# EAGLE schematic 3109-comparisons (EAGLE 6.5.0)
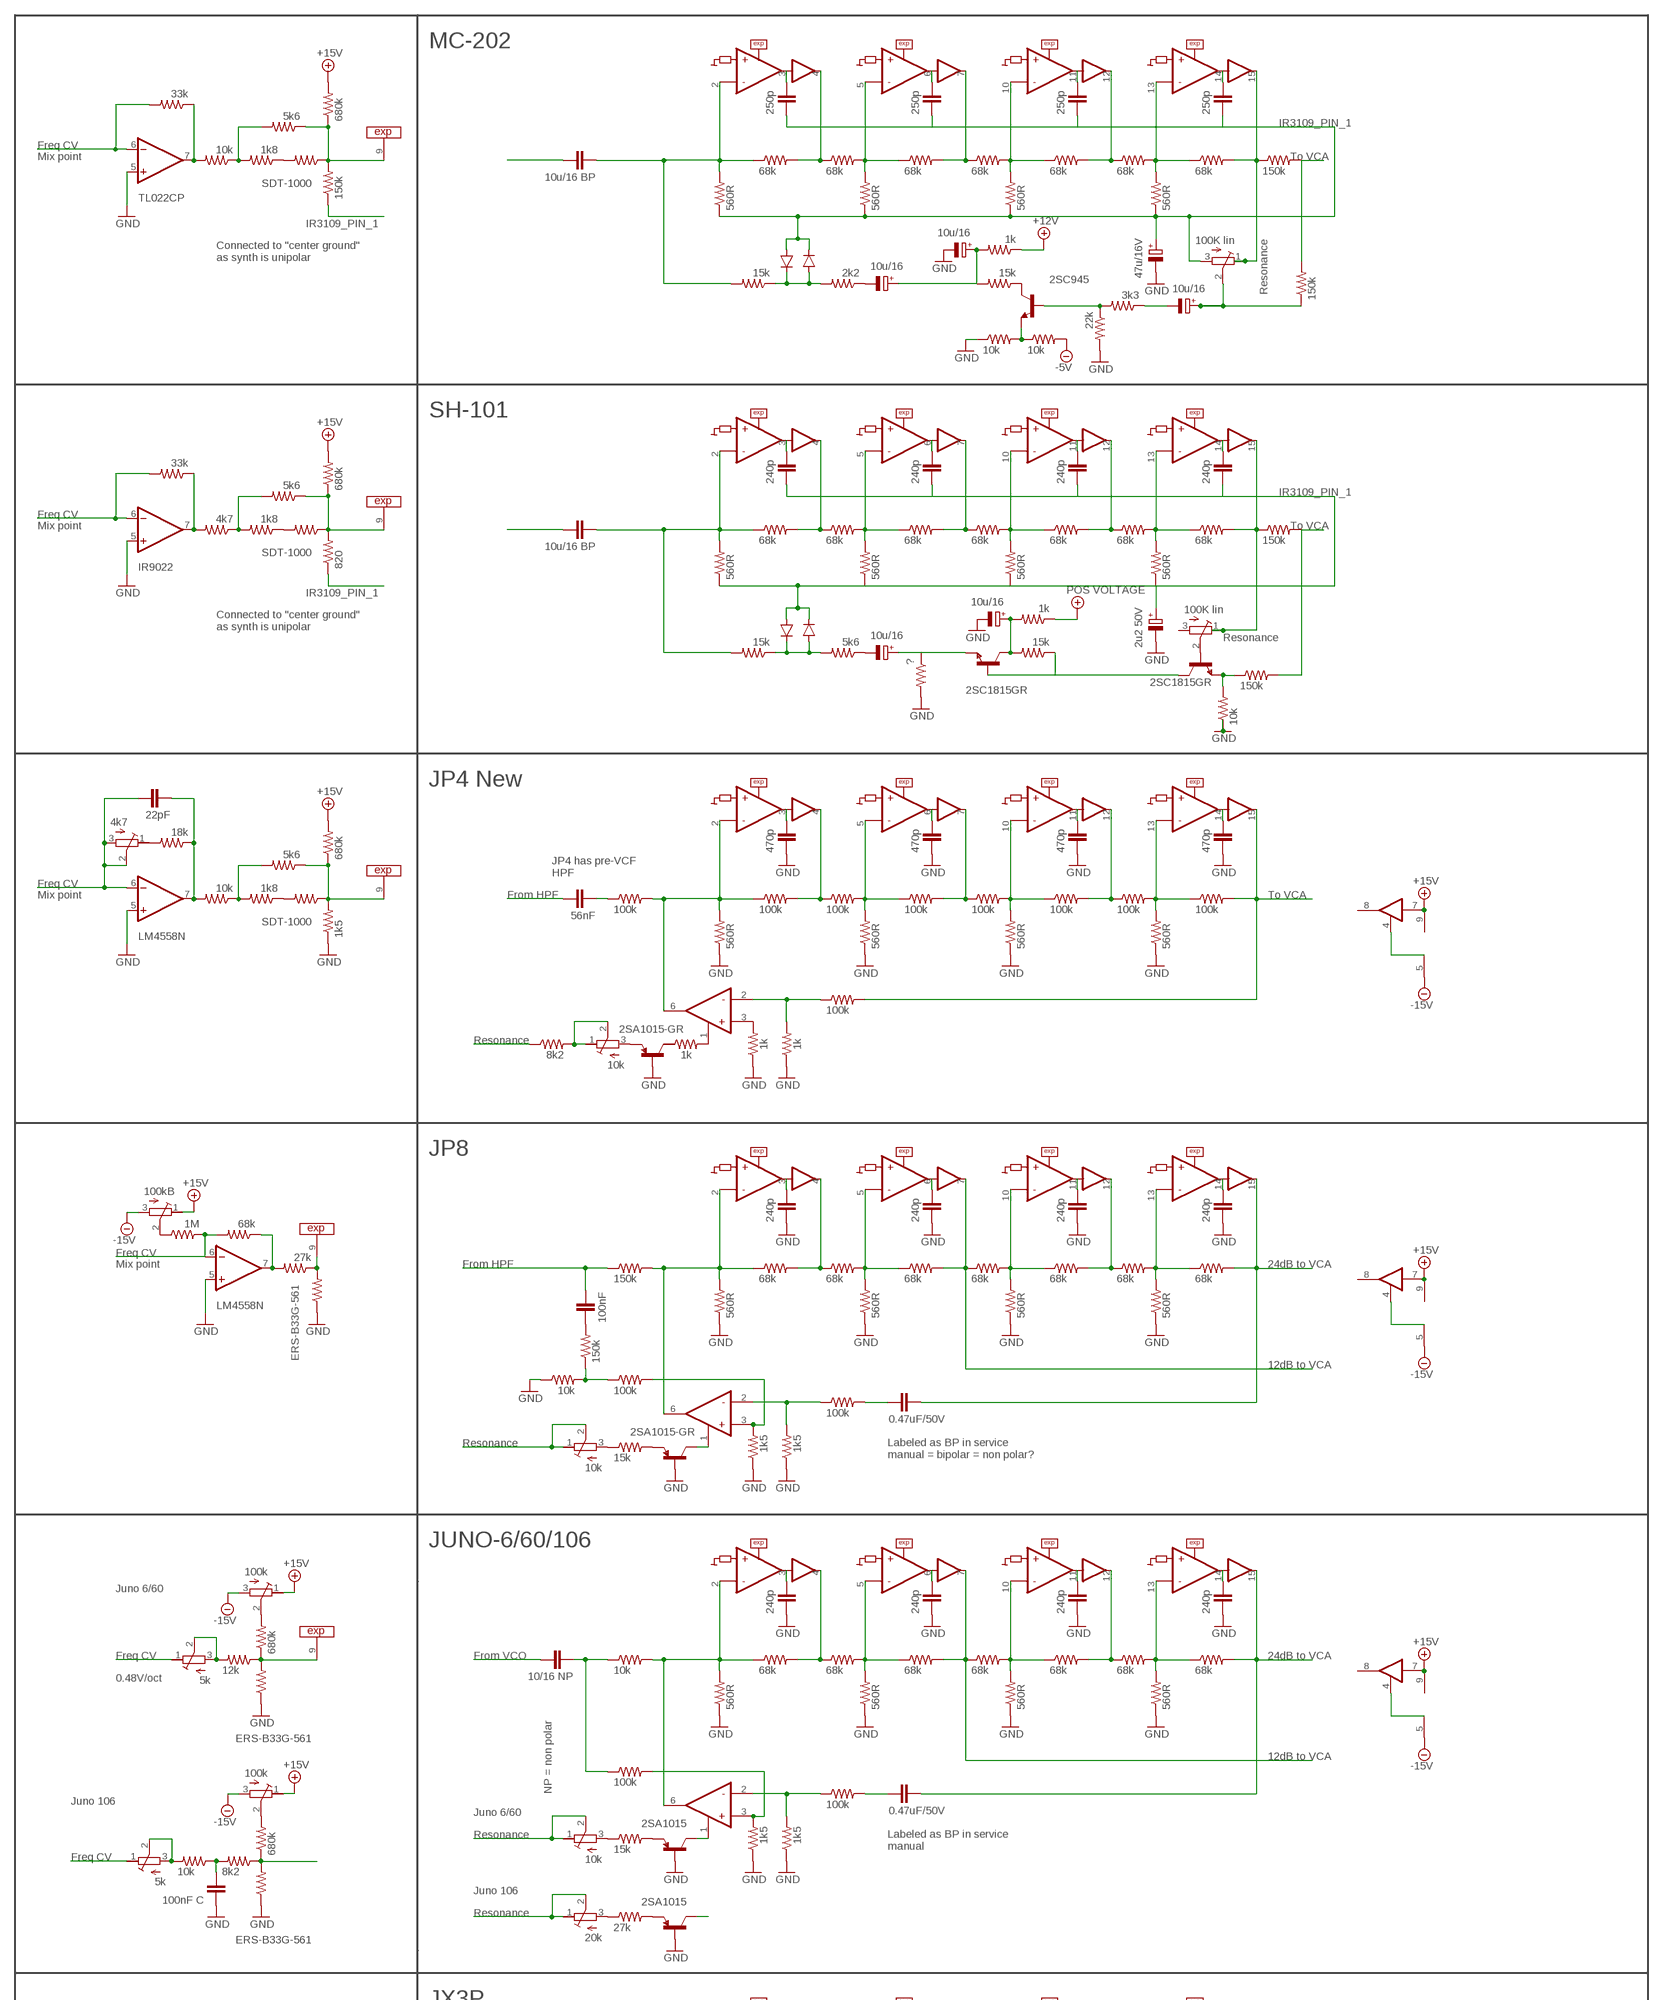
[diagram p0: schematic, sheet 1, part 1 of 2]
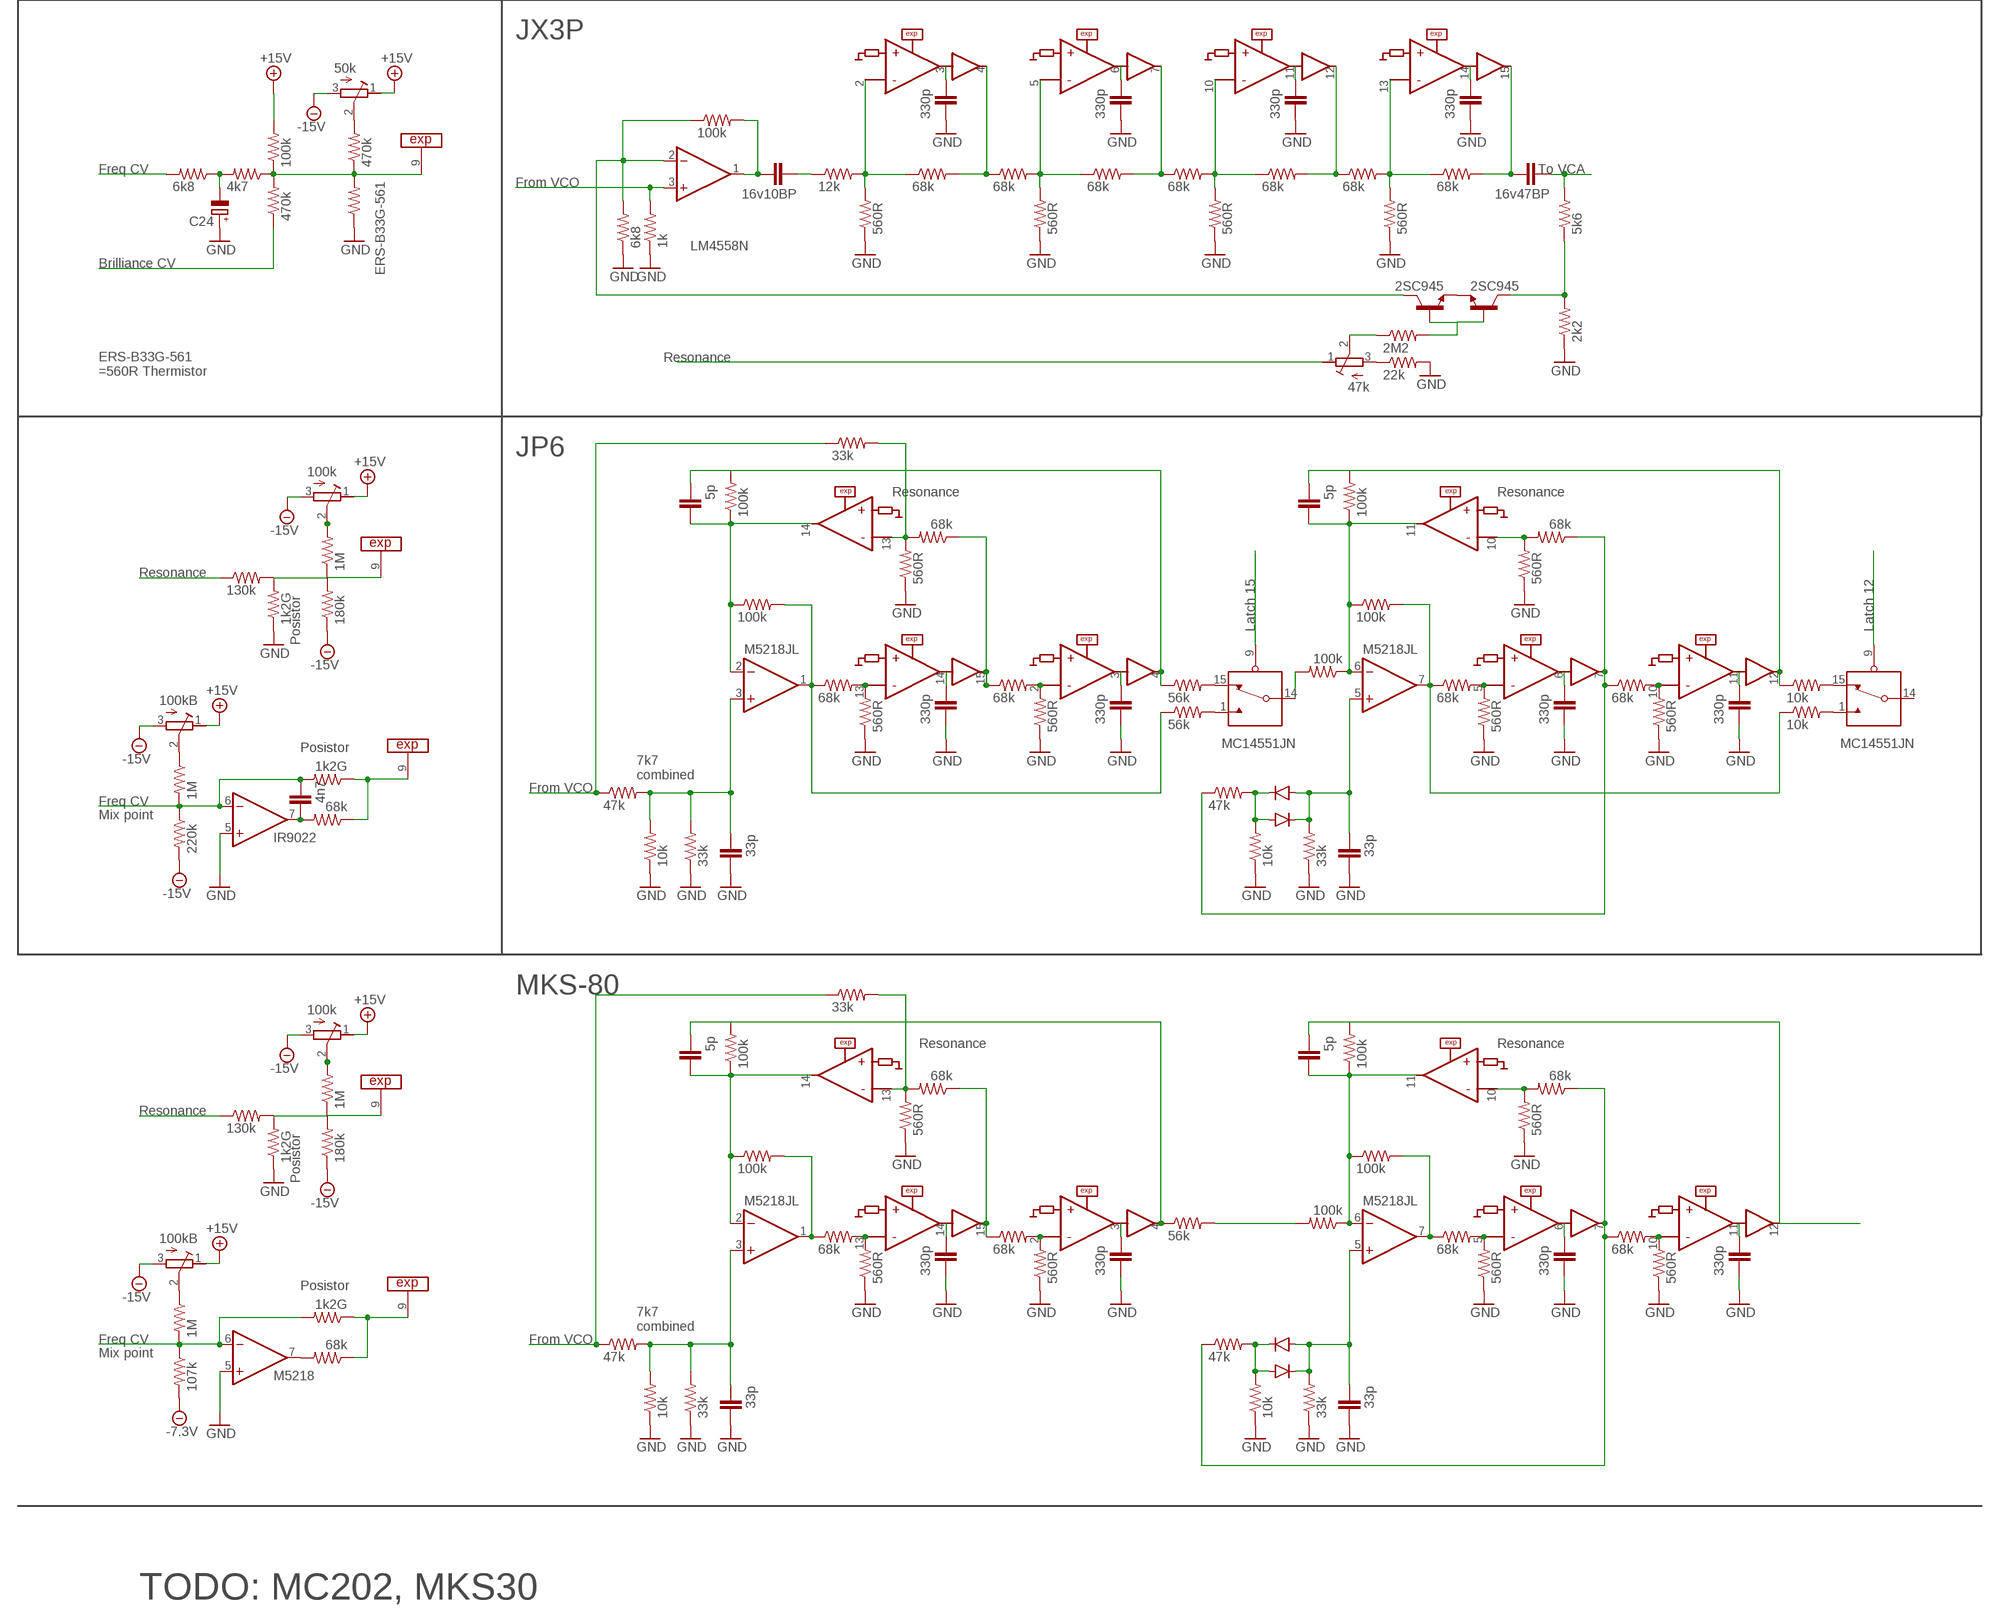
[diagram p1: schematic, sheet 1, part 2 of 2]

## Parts
C1  470p  C-EU025-024X044  [C025-024X044]
C2  470p  C-EU025-024X044  [C025-024X044]
C3  470p  C-EU025-024X044  [C025-024X044]
C4  470p  C-EU025-024X044  [C025-024X044]
C5  240p  C-EU025-024X044  [C025-024X044]
C6  240p  C-EU025-024X044  [C025-024X044]
C7  240p  C-EU025-024X044  [C025-024X044]
C8  240p  C-EU025-024X044  [C025-024X044]
C9  100nF  C-EU025-024X044  [C025-024X044]
C10  0.47uF/50V  C-EU025-024X044  [C025-024X044]
C11  240p  C-EU025-024X044  [C025-024X044]
C12  240p  C-EU025-024X044  [C025-024X044]
C13  240p  C-EU025-024X044  [C025-024X044]
C14  240p  C-EU025-024X044  [C025-024X044]
C15  10/16 NP  C-EU025-024X044  [C025-024X044]
C16  0.47uF/50V  C-EU025-024X044  [C025-024X044]
C17  330p  C-EU025-024X044  [C025-024X044]
C18  330p  C-EU025-024X044  [C025-024X044]
C19  330p  C-EU025-024X044  [C025-024X044]
C20  330p  C-EU025-024X044  [C025-024X044]
C21  16v47BP  C-EU025-024X044  [C025-024X044]
C22  16v10BP  C-EU025-024X044  [C025-024X044]
C23  56nF  C-EU025-024X044  [C025-024X044]
C24  CPOL-EUE2-5  [E2-5]
C25  22pF  C-EU025-024X044  [C025-024X044]
C26  100nF C  C-EU025-024X044  [C025-024X044]
C27  330p  C-EU025-024X044  [C025-024X044]
C28  330p  C-EU025-024X044  [C025-024X044]
C29  330p  C-EU025-024X044  [C025-024X044]
C30  330p  C-EU025-024X044  [C025-024X044]
C31  5p  C-EU025-024X044  [C025-024X044]
C32  33p  C-EU025-024X044  [C025-024X044]
C33  5p  C-EU025-024X044  [C025-024X044]
C34  33p  C-EU025-024X044  [C025-024X044]
C35  4n7  C-EU025-024X044  [C025-024X044]
C36  330p  C-EU025-024X044  [C025-024X044]
C37  330p  C-EU025-024X044  [C025-024X044]
C38  330p  C-EU025-024X044  [C025-024X044]
C39  330p  C-EU025-024X044  [C025-024X044]
C40  5p  C-EU025-024X044  [C025-024X044]
C41  33p  C-EU025-024X044  [C025-024X044]
C42  5p  C-EU025-024X044  [C025-024X044]
C43  33p  C-EU025-024X044  [C025-024X044]
C44  240p  C-EU025-024X044  [C025-024X044]
C45  240p  C-EU025-024X044  [C025-024X044]
C46  240p  C-EU025-024X044  [C025-024X044]
C47  240p  C-EU025-024X044  [C025-024X044]
C48  10u/16 BP  C-EU025-024X044  [C025-024X044]
C49  250p  C-EU025-024X044  [C025-024X044]
C50  2u2 50V  CPOL-EUE2-5  [E2-5]
C51  10u/16  CPOL-EUE2-5  [E2-5]
C52  10u/16  CPOL-EUE2-5  [E2-5]
C53  250p  C-EU025-024X044  [C025-024X044]
C54  250p  C-EU025-024X044  [C025-024X044]
C55  250p  C-EU025-024X044  [C025-024X044]
C56  10u/16 BP  C-EU025-024X044  [C025-024X044]
C57  47u/16V  CPOL-EUE2-5  [E2-5]
C58  10u/16  CPOL-EUE2-5  [E2-5]
C59  10u/16  CPOL-EUE2-5  [E2-5]
C60  10u/16  CPOL-EUE2-5  [E2-5]
D1  1S24735  [DO35-5J]
D2  1S24735  [DO35-5J]
D3  1S24735  [DO35-5J]
D4  1S24735  [DO35-5J]
D5  1S24735  [DO35-5J]
D6  1S24735  [DO35-5J]
D7  1S24735  [DO35-5J]
D8  1S24735  [DO35-5J]
IC1  LM4558N  [DIL08]
IC2  LM4558N  [DIL08]
IC3  LM4558N  [DIL08]
IC4  M5218JL  [SIP-8J]
IC5  MC14551JN  [DIL16J]
IC6  MC14551JN  [DIL16J]
IC7  M5218JL  [SIP-8J]
IC8  M5218  M5218JL  [SIP-8J]
IC9  IR9022  LM4558N  [DIL08]
IC10  TL022CP  LM4558N  [DIL08]
Q1  2SA1015  [TO-92J]
Q2  2SA1015-GR  2SA1015  [TO-92J]
Q3  2SA1015-GR  2SA1015  [TO-92J]
Q4  2SA1015  [TO-92J]
R1  100k  R-US_0204/7  [0204/7]
R2  100k  R-US_0204/7  [0204/7]
R3  100k  R-US_0204/7  [0204/7]
R4  100k  R-US_0204/7  [0204/7]
R5  100k  R-US_0204/7  [0204/7]
R6  100k  R-US_0204/7  [0204/7]
R7  100k  R-US_0204/7  [0204/7]
R8  560R  R-US_0204/7  [0204/7]
R9  560R  R-US_0204/7  [0204/7]
R10  560R  R-US_0204/7  [0204/7]
R11  560R  R-US_0204/7  [0204/7]
R12  100k  R-US_0204/7  [0204/7]
R13  1k  R-US_0204/7  [0204/7]
R14  1k  R-US_0204/7  [0204/7]
R15  100k  R-US_0204/7  [0204/7]
R16  68k  R-US_0204/7  [0204/7]
R17  68k  R-US_0204/7  [0204/7]
R18  68k  R-US_0204/7  [0204/7]
R19  68k  R-US_0204/7  [0204/7]
R20  68k  R-US_0204/7  [0204/7]
R21  68k  R-US_0204/7  [0204/7]
R22  68k  R-US_0204/7  [0204/7]
R23  560R  R-US_0204/7  [0204/7]
R24  560R  R-US_0204/7  [0204/7]
R25  560R  R-US_0204/7  [0204/7]
R26  560R  R-US_0204/7  [0204/7]
R27  100k  R-US_0204/7  [0204/7]
R28  1k5  R-US_0204/7  [0204/7]
R29  1k5  R-US_0204/7  [0204/7]
R30  150k  R-US_0204/7  [0204/7]
R31  100k  R-US_0204/7  [0204/7]
R32  10k  R-US_0204/7  [0204/7]
R33  150k  R-US_0204/7  [0204/7]
R34  68k  R-US_0204/7  [0204/7]
R35  68k  R-US_0204/7  [0204/7]
R36  68k  R-US_0204/7  [0204/7]
R37  68k  R-US_0204/7  [0204/7]
R38  68k  R-US_0204/7  [0204/7]
R39  68k  R-US_0204/7  [0204/7]
R40  68k  R-US_0204/7  [0204/7]
R41  560R  R-US_0204/7  [0204/7]
R42  560R  R-US_0204/7  [0204/7]
R43  560R  R-US_0204/7  [0204/7]
R44  560R  R-US_0204/7  [0204/7]
R45  100k  R-US_0204/7  [0204/7]
R46  1k5  R-US_0204/7  [0204/7]
R47  1k5  R-US_0204/7  [0204/7]
R48  10k  R-US_0204/7  [0204/7]
R49  100k  R-US_0204/7  [0204/7]
R50  15k  R-US_0204/7  [0204/7]
R51  10k  R-TRIMMT93XA  [RTRIMT93XA]
R52  15k  R-US_0204/7  [0204/7]
R53  10k  R-TRIMMT93XA  [RTRIMT93XA]
R54  68k  R-US_0204/7  [0204/7]
R55  68k  R-US_0204/7  [0204/7]
R56  68k  R-US_0204/7  [0204/7]
R57  68k  R-US_0204/7  [0204/7]
R58  68k  R-US_0204/7  [0204/7]
R59  68k  R-US_0204/7  [0204/7]
R60  68k  R-US_0204/7  [0204/7]
R61  560R  R-US_0204/7  [0204/7]
R62  560R  R-US_0204/7  [0204/7]
R63  560R  R-US_0204/7  [0204/7]
R64  560R  R-US_0204/7  [0204/7]
R65  12k  R-US_0204/7  [0204/7]
R66  5k6  R-US_0204/7  [0204/7]
R67  2k2  R-US_0204/7  [0204/7]
R68  100k  R-US_0204/7  [0204/7]
R69  1k  R-US_0204/7  [0204/7]
R70  6k8  R-US_0204/7  [0204/7]
R71  2M2  R-US_0204/7  [0204/7]
R72  47k  R-TRIMMT93XA  [RTRIMT93XA]
R73  22k  R-US_0204/7  [0204/7]
R74  8k2  R-US_0204/7  [0204/7]
R75  10k  R-TRIMMT93XA  [RTRIMT93XA]
R76  1k  R-US_0204/7  [0204/7]
R77  ERS-B33G-561  R-US_0204/7  [0204/7]
R78  27k  R-US_0204/7  [0204/7]
R79  68k  R-US_0204/7  [0204/7]
R80  1M  R-US_0204/7  [0204/7]
R81  100kB  R-TRIMMT93XA  [RTRIMT93XA]
R82  ERS-B33G-561  R-US_0204/7  [0204/7]
R83  4k7  R-US_0204/7  [0204/7]
R84  100k  R-US_0204/7  [0204/7]
R85  ERS-B33G-561  R-US_0204/7  [0204/7]
R86  50k  R-TRIMMT93XA  [RTRIMT93XA]
R87  470k  R-US_0204/7  [0204/7]
R88  470k  R-US_0204/7  [0204/7]
R89  6k8  R-US_0204/7  [0204/7]
R90  12k  R-US_0204/7  [0204/7]
R91  5k  R-TRIMMT93XA  [RTRIMT93XA]
R92  100k  R-TRIMMT93XA  [RTRIMT93XA]
R93  680k  R-US_0204/7  [0204/7]
R94  1k5  R-US_0204/7  [0204/7]
R95  SDT-1000  R-US_0204/7  [0204/7]
R96  27k  R-US_0204/7  [0204/7]
R97  20k  R-TRIMMT93XA  [RTRIMT93XA]
R98  ERS-B33G-561  R-US_0204/7  [0204/7]
R99  1k8  R-US_0204/7  [0204/7]
R100  10k  R-US_0204/7  [0204/7]
R101  18k  R-US_0204/7  [0204/7]
R102  4k7  R-TRIMMT93XA  [RTRIMT93XA]
R103  5k6  R-US_0204/7  [0204/7]
R104  680k  R-US_0204/7  [0204/7]
R105  8k2  R-US_0204/7  [0204/7]
R106  100k  R-TRIMMT93XA  [RTRIMT93XA]
R107  680k  R-US_0204/7  [0204/7]
R108  5k  R-TRIMMT93XA  [RTRIMT93XA]
R109  10k  R-US_0204/7  [0204/7]
R110  56k  R-US_0204/7  [0204/7]
R111  68k  R-US_0204/7  [0204/7]
R112  56k  R-US_0204/7  [0204/7]
R113  68k  R-US_0204/7  [0204/7]
R114  10k  R-US_0204/7  [0204/7]
R115  68k  R-US_0204/7  [0204/7]
R116  10k  R-US_0204/7  [0204/7]
R117  560R  R-US_0204/7  [0204/7]
R118  560R  R-US_0204/7  [0204/7]
R119  560R  R-US_0204/7  [0204/7]
R120  560R  R-US_0204/7  [0204/7]
R121  68k  R-US_0204/7  [0204/7]
R122  68k  R-US_0204/7  [0204/7]
R123  560R  R-US_0204/7  [0204/7]
R124  100k  R-US_0204/7  [0204/7]
R125  100k  R-US_0204/7  [0204/7]
R126  33k  R-US_0204/7  [0204/7]
R127  10k  R-US_0204/7  [0204/7]
R128  47k  R-US_0204/7  [0204/7]
R129  33k  R-US_0204/7  [0204/7]
R130  100k  R-US_0204/7  [0204/7]
R131  68k  R-US_0204/7  [0204/7]
R132  560R  R-US_0204/7  [0204/7]
R133  100k  R-US_0204/7  [0204/7]
R134  100k  R-US_0204/7  [0204/7]
R135  33k  R-US_0204/7  [0204/7]
R136  10k  R-US_0204/7  [0204/7]
R137  47k  R-US_0204/7  [0204/7]
R138  100k  R-TRIMMT93XA  [RTRIMT93XA]
R139  1k2G  R-US_0204/7  [0204/7]
R140  130k  R-US_0204/7  [0204/7]
R141  1k2G  R-US_0204/7  [0204/7]
R142  180k  R-US_0204/7  [0204/7]
R143  1M  R-US_0204/7  [0204/7]
R144  68k  R-US_0204/7  [0204/7]
R145  220k  R-US_0204/7  [0204/7]
R146  1M  R-US_0204/7  [0204/7]
R147  100kB  R-TRIMMT93XA  [RTRIMT93XA]
R148  68k  R-US_0204/7  [0204/7]
R149  68k  R-US_0204/7  [0204/7]
R150  68k  R-US_0204/7  [0204/7]
R151  560R  R-US_0204/7  [0204/7]
R152  560R  R-US_0204/7  [0204/7]
R153  560R  R-US_0204/7  [0204/7]
R154  560R  R-US_0204/7  [0204/7]
R155  68k  R-US_0204/7  [0204/7]
R156  56k  R-US_0204/7  [0204/7]
R157  130k  R-US_0204/7  [0204/7]
R158  1k2G  R-US_0204/7  [0204/7]
R159  180k  R-US_0204/7  [0204/7]
R160  68k  R-US_0204/7  [0204/7]
R161  560R  R-US_0204/7  [0204/7]
R162  100k  R-US_0204/7  [0204/7]
R163  100k  R-US_0204/7  [0204/7]
R164  33k  R-US_0204/7  [0204/7]
R165  10k  R-US_0204/7  [0204/7]
R166  47k  R-US_0204/7  [0204/7]
R167  33k  R-US_0204/7  [0204/7]
R168  100k  R-US_0204/7  [0204/7]
R169  68k  R-US_0204/7  [0204/7]
R170  560R  R-US_0204/7  [0204/7]
R171  100k  R-US_0204/7  [0204/7]
R172  100k  R-US_0204/7  [0204/7]
R173  33k  R-US_0204/7  [0204/7]
R174  10k  R-US_0204/7  [0204/7]
R175  47k  R-US_0204/7  [0204/7]
R176  1M  R-US_0204/7  [0204/7]
R177  100k  R-TRIMMT93XA  [RTRIMT93XA]
R178  68k  R-US_0204/7  [0204/7]
R179  1M  R-US_0204/7  [0204/7]
R180  100kB  R-TRIMMT93XA  [RTRIMT93XA]
R181  1k2G  R-US_0204/7  [0204/7]
R182  107k  R-US_0204/7  [0204/7]
R183  68k  R-US_0204/7  [0204/7]
R184  68k  R-US_0204/7  [0204/7]
R185  68k  R-US_0204/7  [0204/7]
R186  68k  R-US_0204/7  [0204/7]
R187  68k  R-US_0204/7  [0204/7]
R188  68k  R-US_0204/7  [0204/7]
R189  68k  R-US_0204/7  [0204/7]
R190  560R  R-US_0204/7  [0204/7]
R191  560R  R-US_0204/7  [0204/7]
R192  560R  R-US_0204/7  [0204/7]
R193  560R  R-US_0204/7  [0204/7]
R194  150k  R-US_0204/7  [0204/7]
R195  150k  R-US_0204/7  [0204/7]
R196  100K lin  R-TRIMMT93XA  [RTRIMT93XA]
R197  68k  R-US_0204/7  [0204/7]
R198  15k  R-US_0204/7  [0204/7]
R199  1k  R-US_0204/7  [0204/7]
R200  ?  R-US_0204/7  [0204/7]
R201  820  R-US_0204/7  [0204/7]
R202  SDT-1000  R-US_0204/7  [0204/7]
R203  1k8  R-US_0204/7  [0204/7]
R204  4k7  R-US_0204/7  [0204/7]
R205  33k  R-US_0204/7  [0204/7]
R206  5k6  R-US_0204/7  [0204/7]
R207  680k  R-US_0204/7  [0204/7]
R208  15k  R-US_0204/7  [0204/7]
R209  10k  R-US_0204/7  [0204/7]
R212  68k  R-US_0204/7  [0204/7]
R213  68k  R-US_0204/7  [0204/7]
R214  68k  R-US_0204/7  [0204/7]
R215  10k  R-US_0204/7  [0204/7]
R216  5k6  R-US_0204/7  [0204/7]
R217  15k  R-US_0204/7  [0204/7]
R218  68k  R-US_0204/7  [0204/7]
R219  68k  R-US_0204/7  [0204/7]
R220  68k  R-US_0204/7  [0204/7]
R221  560R  R-US_0204/7  [0204/7]
R222  560R  R-US_0204/7  [0204/7]
R223  560R  R-US_0204/7  [0204/7]
R224  560R  R-US_0204/7  [0204/7]
R225  150k  R-US_0204/7  [0204/7]
R226  150k  R-US_0204/7  [0204/7]
R227  SDT-1000  R-US_0204/7  [0204/7]
R228  1k8  R-US_0204/7  [0204/7]
R229  10k  R-US_0204/7  [0204/7]
R230  33k  R-US_0204/7  [0204/7]
R231  5k6  R-US_0204/7  [0204/7]
R232  680k  R-US_0204/7  [0204/7]
R237  150k  R-US_0204/7  [0204/7]
R238  10k  R-US_0204/7  [0204/7]
R239  100K lin  R-TRIMMT93XA  [RTRIMT93XA]
R241  1k  R-US_0204/7  [0204/7]
R243  2k2  R-US_0204/7  [0204/7]
R244  15k  R-US_0204/7  [0204/7]
R245  3k3  R-US_0204/7  [0204/7]
R246  22k  R-US_0204/7  [0204/7]
T3  2SC945  [TO92-ECB]
T4  2SC945  [TO92-ECB]
T5  2SC1815GR  2SC945  [TO92-ECB]
T6  2SC1815GR  2SC945  [TO92-ECB]
T10  2SC945  [TO92-ECB]
U$1  IR3109  [DIL16J]
U$2  BA662-J  [SIP-9J]
U$3  IR3109  [DIL16J]
U$4  BA662-J  [SIP-9J]
U$5  IR3109  [DIL16J]
U$6  BA662-J  [SIP-9J]
U$7  IR3109  [DIL16J]
U$8  IR9022  [DIL08J]
U$9  IR3109  [DIL16J]
U$10  IR3109  [DIL16J]
U$11  IR3109-OTA  [DIL16J]
U$12  IR3109-OTA  [DIL16J]
U$13  IR3109  [DIL16J]
U$14  IR3109-OTA  [DIL16J]
U$15  IR3109  [DIL16J]
U$17  IR3109  [DIL16J]

## Nets
+12V: R241.1
+15V: R81.1(A) R84.2 R86.1(A) R92.1(A) R104.2 R106.1(A) R138.1(A) R147.1(A) R177.1(A) R180.1(A) R199.1 R207.2 R232.2 U$2.7(IN_BUFF) U$2.9(V+) U$4.7(IN_BUFF) U$4.9(V+) U$6.7(IN_BUFF) U$6.9(V+) ; supply symbol labelled POS VOLTAGE
-5V: R238.2
-8V: R182.2 ; supply symbol labelled -7.3V
-15V: R81.3(E) R86.3(E) R92.3(E) R106.3(E) R138.3(E) R142.1 R145.2 R147.3(E) R159.1 R177.3(E) R180.3(E) U$2.5(V-) U$4.5(V-) U$6.5(V-)
GND: C1.2 C2.2 C3.2 C4.2 C5.2 C6.2 C7.2 C8.2 C11.2 C12.2 C13.2 C14.2 C17.2 C18.2 C19.2 C20.2 C24.+ C26.2 C27.2 C28.2 C29.2 C30.2 C32.1 C34.1 C36.2 C37.2 C38.2 C39.2 C41.1 C43.1 C50.- C51.- C57.- C58.- IC1.5(B:+IN) IC3.5(B:+IN) IC8.5(B:+IN) IC9.5(B:+IN) IC10.5(B:+IN) Q1.3(B) Q2.3(B) Q3.3(B) Q4.3(B) R8.1 R9.1 R10.1 R11.1 R13.1 R14.1 R23.1 R24.1 R25.1 R26.1 R28.1 R29.1 R32.1 R41.1 R42.1 R43.1 R44.1 R46.1 R47.1 R61.1 R62.1 R63.1 R64.1 R67.1 R69.1 R70.1 R73.2 R77.1 R82.1 R85.1 R94.1 R98.1 R117.1 R118.1 R119.1 R120.1 R123.1 R126.1 R127.1 R132.1 R135.1 R136.1 R141.1 R151.1 R152.1 R153.1 R154.1 R158.1 R161.1 R164.1 R165.1 R170.1 R173.1 R174.1 R200.2 R209.1 R215.1 R246.2 U$8.5(+IN)
IR3109_PIN_1: C44.2 C45.2 C46.2 C47.2 C49.2 C50.+ C53.2 C54.2 C55.2 C57.+ D5.C D6.A D7.C D8.A R190.1 R191.1 R192.1 R193.1 R201.1 R221.1 R222.1 R223.1 R224.1 R226.1 R239.3(E)
N$1: C1.1 U$1.3(CAP)
N$2: C2.1 U$1.6(CAP)
N$3: C3.1 U$1.11(CAP)
N$4: C4.1 U$1.14(CAP)
N$5: R1.2 R2.1 U$1.4(OUT)
N$6: R1.1 R9.2 R15.2 U$1.2(IN) U$2.6(OUT_OTA)
N$7: R2.2 R3.1 R8.2 U$1.5(IN)
N$8: R3.2 R4.1 U$1.7(OUT)
N$9: R4.2 R5.1 R10.2 U$1.10(IN)
N$10: R5.2 R6.1 U$1.12(OUT)
N$11: R6.2 R7.1 R11.2 U$1.13(IN)
N$12: R7.2 R12.2 U$1.15(OUT)
N$13: R14.2 U$2.3(+)
N$14: R12.1 R13.2 U$2.2(-)
N$15: C23.2 R15.1
N$16: R76.2 U$2.1(C_OTA)
N$17: U$2.4(C_BUFF)
N$18: R95.2 R99.1
N$19: C5.1 U$3.3(CAP)
N$20: C6.1 U$3.6(CAP)
N$21: C7.1 U$3.11(CAP)
N$22: C8.1 U$3.14(CAP)
N$23: R16.2 R17.1 U$3.4(OUT)
N$24: R16.1 R24.2 R30.2 U$3.2(IN) U$4.6(OUT_OTA)
N$25: R17.2 R18.1 R23.2 U$3.5(IN)
N$26: R18.2 R19.1 U$3.7(OUT)
N$27: R19.2 R20.1 R25.2 U$3.10(IN)
N$28: R20.2 R21.1 U$3.12(OUT)
N$29: R21.2 R22.1 R26.2 U$3.13(IN)
N$30: C10.1 R22.2 U$3.15(OUT)
N$31: R29.2 R31.2 U$4.3(+)
N$32: R27.1 R28.2 U$4.2(-)
N$33: C9.1 R30.1
N$34: Q3.1(E) R75.3(E)
N$35: U$4.4(C_BUFF)
N$36: R80.1 R81.2(S)
N$37: R31.1 R32.2 R33.1
N$38: C9.2 R33.2
N$39: C10.2 R27.2
N$40: C11.1 U$5.3(CAP)
N$41: C12.1 U$5.6(CAP)
N$42: C13.1 U$5.11(CAP)
N$43: C14.1 U$5.14(CAP)
N$44: R34.2 R35.1 U$5.4(OUT)
N$45: R34.1 R42.2 R48.2 U$5.2(IN) U$6.6(OUT_OTA)
N$46: R35.2 R36.1 R41.2 U$5.5(IN)
N$47: R36.2 R37.1 U$5.7(OUT)
N$48: R37.2 R38.1 R43.2 U$5.10(IN)
N$49: R38.2 R39.1 U$5.12(OUT)
N$50: R39.2 R40.1 R44.2 U$5.13(IN)
N$51: C16.1 R40.2 U$5.15(OUT)
N$52: R47.2 R49.2 U$6.3(+)
N$53: R45.1 R46.2 U$6.2(-)
N$54: C15.2 R48.1 R49.1
N$55: Q1.2(C) U$6.1(C_OTA)
N$56: U$6.4(C_BUFF)
N$57: C28.1 U$9.3(CAP)
N$58: C15.1
N$59: Q1.1(E) R50.2
N$60: C16.2 R45.2
N$61: R50.1 R51.3(E)
N$62: R51.1(A) R51.2(S)
N$63: R74.1
N$64: Q2.2(C) U$4.1(C_OTA)
N$65: C17.1 U$7.3(CAP)
N$66: C18.1 U$7.6(CAP)
N$67: C19.1 U$7.11(CAP)
N$68: C20.1 U$7.14(CAP)
N$69: R54.2 R55.1 U$7.4(OUT)
N$70: R54.1 R62.2 R65.2 U$7.2(IN)
N$71: R55.2 R56.1 R61.2 U$7.5(IN)
N$72: R56.2 R57.1 U$7.7(OUT)
N$73: R57.2 R58.1 R63.2 U$7.10(IN)
N$74: R58.2 R59.1 U$7.12(OUT)
N$75: R59.2 R60.1 R64.2 U$7.13(IN)
N$76: IC2.2(A:-IN) R68.1 R70.2 T3.C
N$77: C22.2 R65.1
N$78: R72.1(A)
N$79: R152.2 R155.2 U$10.13(IN)
N$80: R90.2 R91.2(S) R91.3(E)
N$81: C21.1 R60.2 U$7.15(OUT)
N$82: C21.2 R66.2
N$83: C22.1 IC2.1(A:OUT) R68.2
N$84: IC2.3(A:+IN) R69.2
N$85: R66.1 R67.2 T4.C
N$86: T3.E T4.E
N$87: R71.2 T3.B T4.B
N$88: R71.1 R72.2(S)
N$89: R72.3(E) R73.1
N$90: Q2.1(E) R52.2
N$91: R52.1 R53.3(E)
N$92: R53.1(A) R53.2(S)
N$93: C23.1
N$94: R74.2 R75.1(A) R75.2(S)
N$95: IC1.7(B:OUT) R78.2 R79.1
N$96: IC1.6(B:-IN) R79.2 R80.2
N$97: R82.2 R83.1 R84.1 R87.1 R88.2 U$7.9(CTRL)
N$98: R77.2 R78.1 U$3.9(CTRL)
N$99: R88.1
N$100: C24.- R83.2 R89.1
N$101: R86.2(S) R87.2
N$102: R89.2
N$103: R92.2(S) R93.2
N$104: R85.2 R90.1 R93.1 U$5.9(CTRL)
N$105: R99.2 R100.1 R103.2
N$106: R91.1(A)
N$107: C25.2 IC3.7(B:OUT) R100.2 R101.1
N$108: C25.1 IC3.6(B:-IN) R102.2(S) R102.3(E)
N$109: R94.2 R95.1 R103.1 R104.1 U$1.9(CTRL)
N$110: Q4.2(C)
N$111: R101.2 R102.1(A)
N$112: Q4.1(E) R96.2
N$113: R96.1 R97.3(E)
N$114: R97.1(A) R97.2(S)
N$115: R106.2(S) R107.2
N$116: R98.2 R105.1 R107.1
N$117: R108.1(A)
N$118: R108.2(S) R108.3(E) R109.2
N$119: C26.1 R105.2 R109.1
N$120: R128.1 R129.1
N$121: C27.1 U$9.14(CAP)
N$122: R111.1 R122.1 U$9.15(OUT)
N$123: C30.1 U$9.11(CAP)
N$124: R118.2 R121.2 U$9.13(IN)
N$125: R111.2 R117.2 U$9.2(IN)
N$126: C33.2 R114.1 R134.2 U$9.12(OUT)
N$127: R113.2 R119.2 U$9.5(IN)
N$128: C29.1 U$9.6(CAP)
N$129: R115.2 R120.2 U$9.10(IN)
N$130: R115.1 R131.1 R137.1 U$9.7(OUT)
N$131: IC4.1(A:OUT) R112.1 R121.1 R124.2
N$132: IC4.7(B:OUT) R113.1 R116.1 R133.2
N$133: R148.2 R151.2 U$10.2(IN)
N$134: R122.2 R123.2 R129.2 U$11.13(IN)
N$135: C31.1 IC4.2(A:-IN) R124.1 R125.1 U$11.14(CAP)
N$136: C31.2 R110.1 R125.2 U$9.4(OUT)
N$137: IC5.9(CTRL)
N$138: IC5.15 R110.2
N$139: IC5.1 R112.2
N$140: IC6.15 R114.2
N$141: IC6.1 R116.2
N$142: IC5.14(COM) R130.2
N$143: IC6.9(CTRL)
N$144: U$11.9(CTRL)
N$145: R131.2 R132.2 U$11.10(IN)
N$146: R138.2(S) R143.2
N$147: C33.1 IC4.6(B:-IN) R130.1 R133.1 R134.1
N$148: D1.A D2.C R136.2 R137.2
N$149: C34.2 D1.C D2.A IC4.5(B:+IN) R135.2
N$150: R140.1
N$151: C32.2 IC4.3(A:+IN) R126.2 R127.2 R128.2
N$152: R139.1 R144.1 U$9.9(CTRL)
N$153: C35.2 R139.2 R145.1 R146.2 U$8.6(-IN)
N$154: R140.2 R141.2 R142.2 R143.1
N$155: IC8.7(B:OUT) R178.2
N$156: R146.1 R147.2(S)
N$157: R149.2 R153.2 U$10.5(IN)
N$158: R150.2 R154.2 U$10.10(IN)
N$159: R156.2 R168.2
N$160: IC7.7(B:OUT) R149.1 R171.2
N$161: R160.2 R161.2 R167.2 U$12.13(IN)
N$162: C37.1 U$10.3(CAP)
N$163: C36.1 U$10.14(CAP)
N$164: R148.1 R160.1 U$10.15(OUT)
N$165: C39.1 U$10.11(CAP)
N$166: C42.2 R172.2 U$10.12(OUT)
N$167: C38.1 U$10.6(CAP)
N$168: R150.1 R169.1 R175.1 U$10.7(OUT)
N$169: C40.1 IC7.2(A:-IN) R162.1 R163.1 U$12.14(CAP)
N$170: C40.2 R156.1 R163.2 U$10.4(OUT)
N$171: R166.1 R167.1
N$172: IC7.1(A:OUT) R155.1 R162.2
N$173: U$14.9(CTRL)
N$174: R157.2 R158.2 R159.2 R176.1
N$175: R176.2 R177.2(S)
N$176: R157.1
N$177: R169.2 R170.2 U$12.10(IN)
N$178: C42.1 IC7.6(B:-IN) R168.1 R171.1 R172.1 U$12.11(CAP)
N$179: D3.A D4.C R174.2 R175.2
N$180: C43.2 D3.C D4.A IC7.5(B:+IN) R173.2
N$181: C41.2 IC7.3(A:+IN) R164.2 R165.2 R166.2
N$182: R179.1 R180.2(S)
N$183: IC8.6(B:-IN) R179.2 R181.2 R182.1
N$184: C44.1 U$15.3(CAP)
N$185: R178.1 R181.1 U$13.9(CTRL)
N$186: C35.1 R144.2 U$8.7(OUT)
N$187: C45.1 U$15.6(CAP)
N$188: C46.1 U$15.11(CAP)
N$189: C47.1 U$15.14(CAP)
N$190: R183.2 R184.1 U$15.4(OUT)
N$191: C49.1 U$17.3(CAP)
N$192: R184.2 R185.1 R190.2 U$15.5(IN)
N$193: R185.2 R186.1 U$15.7(OUT)
N$194: R186.2 R187.1 R192.2 U$15.10(IN)
N$195: R187.2 R188.1 U$15.12(OUT)
N$196: R188.2 R189.1 R193.2 U$15.13(IN)
N$197: R196.2(S) T5.B
N$198: R189.2 R195.1 R196.1(A) U$15.15(OUT)
N$199: R194.1 R215.2 T5.E
N$200: C48.2 R183.1 R191.2 R217.2 U$15.2(IN)
N$201: R208.1 T10.C
N$202: C51.+ R198.2 R199.2 T6.C
N$203: R194.2 R195.2
N$204: C52.+ R200.1 T6.E
N$205: C52.- R216.1
N$206: C48.1
N$207: IC9.6(B:-IN) R205.2
N$208: R201.2 R202.1 R206.1 R207.1 U$15.9(CTRL)
N$209: R202.2 R203.1
N$210: R203.2 R204.1 R206.2
N$211: C53.1 U$17.6(CAP)
N$212: IC9.7(B:OUT) R204.2 R205.1
N$213: C54.1 U$17.11(CAP)
N$219: C55.1 U$17.14(CAP)
N$220: R198.1 T5.C T6.B
N$221: R197.2 R212.1 U$17.4(OUT)
N$222: D7.A D8.C R216.2 R217.1
N$223: R212.2 R213.1 R221.2 U$17.5(IN)
N$224: R213.2 R214.1 U$17.7(OUT)
N$225: R214.2 R218.1 R223.2 U$17.10(IN)
N$226: R218.2 R219.1 U$17.12(OUT)
N$227: R219.2 R220.1 R224.2 U$17.13(IN)
N$228: C56.2 R197.1 R222.2 R244.2 U$17.2(IN)
N$230: C56.1
N$231: IC10.6(B:-IN) R230.2
N$232: R226.2 R227.1 R231.1 R232.1 U$17.9(CTRL)
N$233: R227.2 R228.1
N$234: R228.2 R229.1 R231.2
N$235: IC10.7(B:OUT) R229.2 R230.1
N$241: R220.2 R237.1 R239.1(A) U$17.15(OUT)
N$242: R225.2 R237.2
N$243: C60.+ R225.1 R239.2(S)
N$244: R209.2 R238.1 T10.E
N$245: C60.- R245.1
N$246: C58.+ C59.+ R208.2 R241.2
N$248: C59.- R243.1
N$249: D5.A D6.C R243.2 R244.1
N$250: R245.2 R246.1 T10.B
Unconnected: IC1.1(A:OUT) IC1.2(A:-IN) IC1.3(A:+IN) IC2.5(B:+IN) IC2.6(B:-IN) IC2.7(B:OUT) IC3.1(A:OUT) IC3.2(A:-IN) IC3.3(A:+IN) IC5.2 IC5.3 IC5.4(COM) IC5.5(COM) IC5.6 IC5.10 IC5.11 IC5.12 IC5.13(COM) IC6.2 IC6.3 IC6.4(COM) IC6.5(COM) IC6.6 IC6.10 IC6.11 IC6.12 IC6.13(COM) IC6.14(COM) IC8.1(A:OUT) IC8.2(A:-IN) IC8.3(A:+IN) IC9.1(A:OUT) IC9.2(A:-IN) IC9.3(A:+IN) IC10.1(A:OUT) IC10.2(A:-IN) IC10.3(A:+IN) Q3.2(C) R76.1 R196.3(E) U$1.1(GND) U$2.8(OUT_BUFF) U$3.1(GND) U$4.8(OUT_BUFF) U$5.1(GND) U$6.8(OUT_BUFF) U$7.1(GND) U$8.1(OUT) U$8.2(-IN) U$8.3(+IN) U$9.1(GND) U$10.1(GND) U$10.9(CTRL) U$11.1(GND) U$11.2(IN) U$11.3(CAP) U$11.5(IN) U$11.6(CAP) U$11.11(CAP) U$12.1(GND) U$12.2(IN) U$12.3(CAP) U$12.5(IN) U$12.6(CAP) U$12.9(CTRL) U$13.1(GND) U$13.2(IN) U$13.3(CAP) U$13.4(OUT) U$13.5(IN) U$13.6(CAP) U$13.7(OUT) U$13.10(IN) U$13.11(CAP) U$13.12(OUT) U$13.13(IN) U$13.14(CAP) U$13.15(OUT) U$14.1(GND) U$14.2(IN) U$14.3(CAP) U$14.5(IN) U$14.6(CAP) U$14.10(IN) U$14.11(CAP) U$14.13(IN) U$14.14(CAP) U$15.1(GND) U$17.1(GND)

## Notes on the sheet
- MC-202
- Freq CV
- Mix point | To VCA
- Connected to "center ground"
  as synth is unipolar
- Resonance
- SH-101
- Freq CV
- Mix point | To VCA
- Connected to "center ground"
  as synth is unipolar
- Resonance
- JP4 New
- JP4 has pre-VCF
  HPF
- Freq CV
- Mix point | From HPF | To VCA
- Resonance
- JP8
- Freq CV
- Mix point | From HPF | 24dB to VCA
- 12dB to VCA
- Resonance
- Labeled as BP in service
  manual = bipolar = non polar?
- JUNO-6/60/106
- Juno 6/60
- Freq CV | From VCO | 24dB to VCA
- 0.48V/oct
- 12dB to VCA
- NP = non polar
- Juno 106
- Juno 6/60
- Resonance
- Labeled as BP in service
  manual
- Freq CV
- Juno 106
- Resonance
- JX3P
- Freq CV | To VCA
- From VCO
- Brilliance CV
- Resonance
- ERS-B33G-561
  =560R Thermistor
- JP6
- Resonance | Resonance
- Resonance
- Latch 15 | Latch 12
- Posistor
- Posistor
- 7k7
  combined
- From VCO
- Freq CV
- Mix point
- MKS-80
- Resonance | Resonance
- Resonance
- Posistor
- Posistor
- 7k7
  combined
- Freq CV | From VCO
- Mix point
- TODO: MC202, MKS30

## Power pins joined to a net without a drawn wire
+V: U$1.16(+V) U$3.16(+V) U$5.16(+V) U$7.16(+V) U$9.16(+V) U$10.16(+V) U$11.16(+V) U$12.16(+V) U$13.16(+V) U$14.16(+V) U$15.16(+V) U$17.16(+V)
-V: U$1.8(-V) U$3.8(-V) U$5.8(-V) U$7.8(-V) U$9.8(-V) U$10.8(-V) U$11.8(-V) U$12.8(-V) U$13.8(-V) U$14.8(-V) U$15.8(-V) U$17.8(-V)
GND: IC5.8(P:GND) IC6.8(P:GND)
V+: IC1.8(P:V+) IC2.8(P:V+) IC3.8(P:V+) IC4.8(P:V+) IC7.8(P:V+) IC8.8(P:V+) IC9.8(P:V+) IC10.8(P:V+) U$8.8(V+)
V-: IC1.4(P:V-) IC2.4(P:V-) IC3.4(P:V-) IC4.4(P:V-) IC7.4(P:V-) IC8.4(P:V-) IC9.4(P:V-) IC10.4(P:V-) U$8.4(V-)
VCC: IC5.16(P:VCC) IC6.16(P:VCC)
VEE: IC5.7(P:VEE) IC6.7(P:VEE)

## Library data of the parts
C1-C23 C25-C49 C53-C56 = resistor:C-EU: CAPACITOR, European symbol
C24 C50-C52 C57-C60 = resistor:CPOL-EU: POLARIZED CAPACITOR, European symbol
D1-D8 = joakim:1S2473
IC1-IC3 IC9 IC10 = linear:*4558: OP AMP
IC4 IC7 IC8 = joakim:M5218J: DUAL LOW-NOISE OPERATIONAL AMPLIFIER (DUAL POWER SUPPLY TYPE) Source: Mitsubishi M5218AL/P/FP
IC5 IC6 = joakim:MC14551J: Quad 2-channel analog MULTIPLEXER/DEMULTIPLEXER
Q1-Q4 = joakim:2SA1015
R1-R50 R52 R54-R71 R73 R74 R76-R80 R82-R85 R87-R90 R93-R96 R98-R101 R103-R105 R107 R109-R137 R139-R146 R148-R176 R178 R179 R181-R195 R197-R209 R212-R232 R237 R238 R241 R243-R246 = resistor:R-US_: RESISTOR, American symbol
R51 R53 R72 R75 R81 R86 R91 R92 R97 R102 R106 R108 R138 R147 R177 R180 R196 R239 = resistor:R-TRIMM: Trimm resistor
T3-T6 T10 = transistor:2SC945: NPN Silicon Epitaxial Planar Transistor Source: SEMTECH ELECTRONICS LTD. ... 2SC945 2.pdf
U$1 U$3 U$5 U$7 U$9 U$10 U$13 U$15 U$17 = joakim:IR3109: Roland IR3109 Filter chip. The IR3109 contains four transconductance amplifiers designed for VCF applications in electronic musical instruments.
U$2 U$4 U$6 = joakim:BA662-J
U$8 = joakim:IR9022
U$11 U$12 U$14 = joakim:IR3109-OTA